# EasyEDA Pro project ProProject_DAC8563-shapphire_2023-07-08.epro

# Schematic Schematic1
Create Date: 2023-07-08; Page Name: P1; Project Name: DAC8563-shapphire; Schematic Name: Schematic1; Update Date: 2023-07-08; Company: 嘉立创EDA; Page Size: A4; Version: V1.0
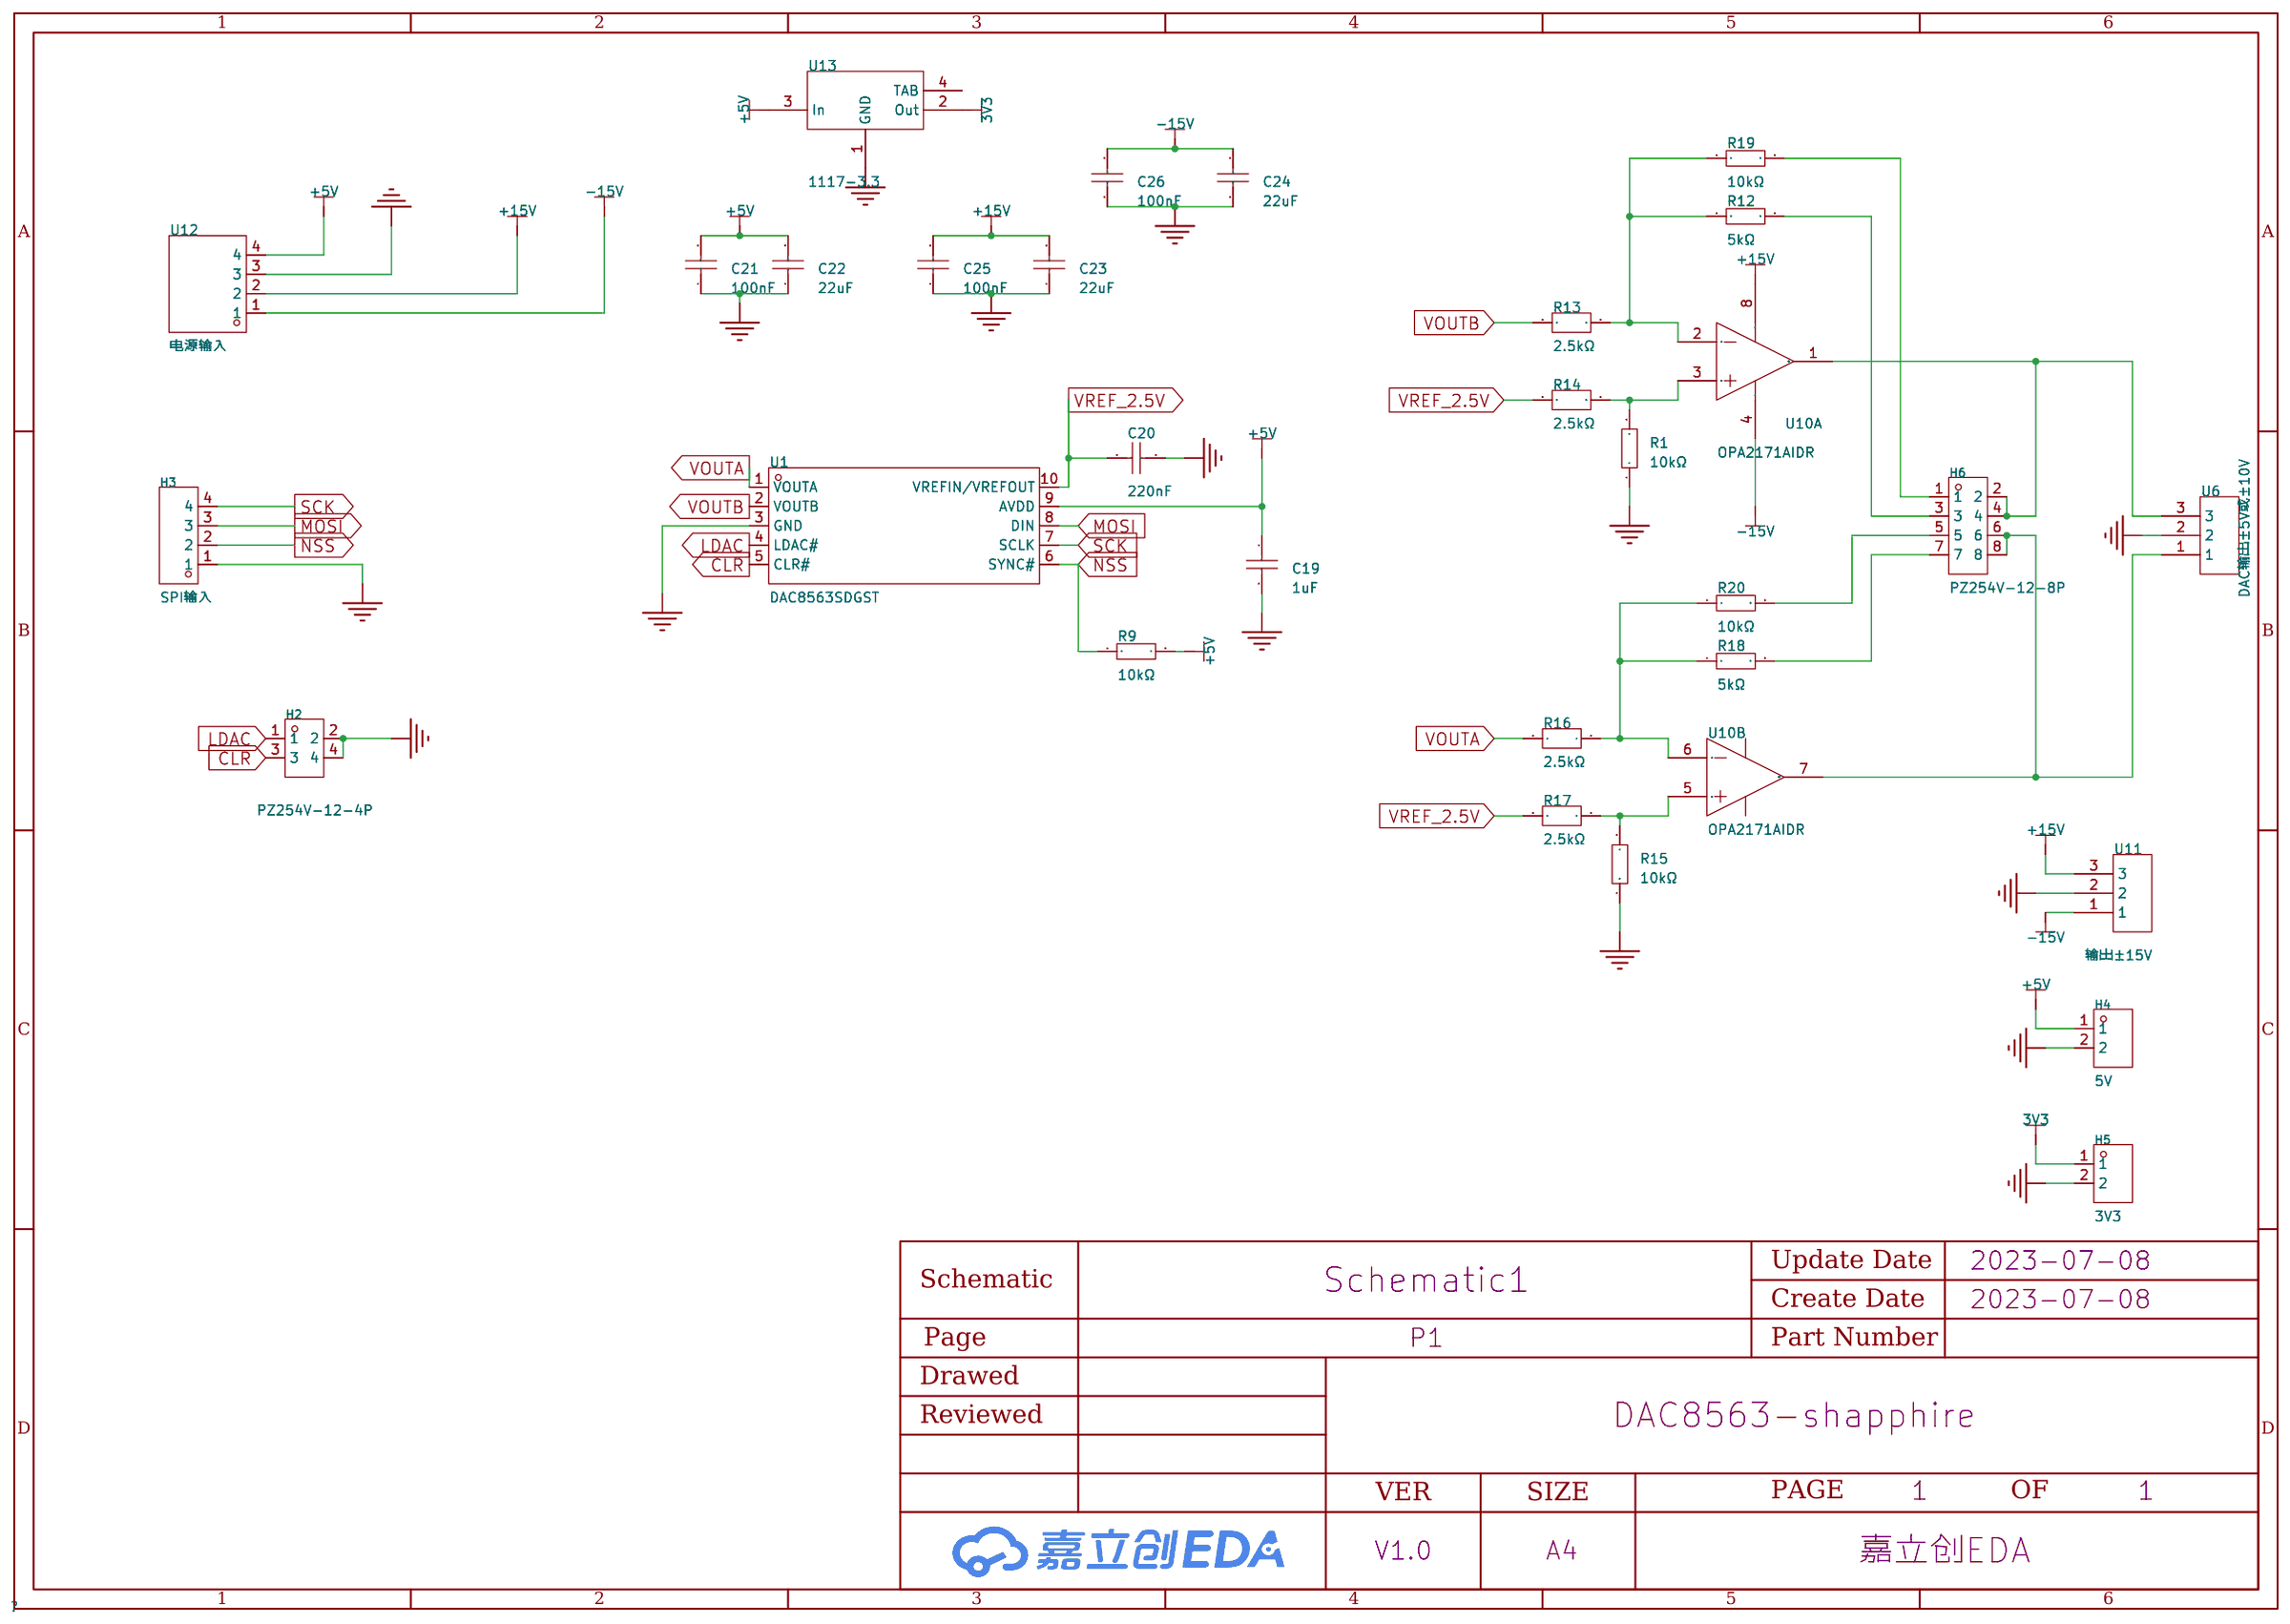
[diagram p0: schematic sheet]

## Parts
C19  1uF  [C0805]
C20  220nF  [C0805]
C21  100nF  [C0805]
C22  22uF  [C0805]
C23  22uF  [C0805]
C24  22uF  [C0805]
C25  100nF  [C0805]
C26  100nF  [C0805]
H2  PZ254V-12-4P  [HDR-TH_4P-P2.54-V-M-R2-C2-S2.54]
H3  SPI输入  [HDR-TH_4P-P2.54-V-M]
H4  5V  [HDR-TH_2P-P2.54-V-M]
H5  3V3  [HDR-TH_2P-P2.54-V-M]
H6  PZ254V-12-8P  [HDR-TH_8P-P2.54-V-M-R2-C4-S2.54]
R1  10kΩ  [R0805]
R9  10kΩ  [R0805]
R12  5kΩ  [R0805]
R13  2.5kΩ  [R0805]
R14  2.5kΩ  [R0805]
R15  10kΩ  [R0805]
R16  2.5kΩ  [R0805]
R17  2.5kΩ  [R0805]
R18  5kΩ  [R0805]
R19  10kΩ  [R0805]
R20  10kΩ  [R0805]
U1  DAC8563SDGST  [VSSOP-10_L3.0-W3.0-P0.50-LS4.9-BL]
U6  DAC输出±5V或±10V  [CONN-TH_3P-P2.50_A2501WV2-3P]
U10  OPA2171AIDR  [SOIC-8_L5.0-W4.0-P1.27-LS6.0-BL]  (sections 1,2)
U11  输出±15V  [CONN-TH_3P-P2.50_A2501WV2-3P]
U12  电源输入  [CONN-TH_B4B-XH-A-LF-SN]
U13  1117-3.3  [SOT-223-3_L6.4-W3.5-P2.30-LS7.0-BR]

## Library data of the parts
C19-C26 = 0805B104K500NT: 容值:100nF;精度:±10%;额定电压:50V;材质(温度系数):X7R;; LCSC Part Name: 100nF ±10% 50V; Supplier Part: C38141; Manufacturer: FH(风华); Supplier Footprint: 0805; JLCPCB Part Class: Extended Part; Datasheet: https://atta.szlcsc.com/upload/public/pdf/source/20170923/C38141_1506149447419988747.pdf; Supplier: LCSC; Tolerance: ±10%; Voltage Rated: 50V; Temperature Coefficient: X7R
H2 = PZ254V-12-4P: 排数:双排;总PIN位数:4;间距:2.54mm;插针结构:2x2P;行距:2.54mm;安装类型:直插;圆针/方针:方针;额定电流:-;额定电压:-;配合针长度:6mm;塑高:2.5mm;端接针长度:3mm;触头材质:黄铜;触头镀层:-;工作温度范围:-40℃~+105℃;颜色:黑色;; LCSC Part Name: 2.54mm 2x2P 直插 方针; Supplier Part: C492419; Manufacturer: XFCN(兴飞); Supplier Footprint: 直插,P=2.54mm; JLCPCB Part Class: 扩展库; Supplier: LCSC; Number of Rows: 双排; Number of Pins: 4; Pitch: 2.54mm; Pin Structure: 2x2P; Row Spacing: 2.54mm; Mounting Type: 直插; Circluar Pins/Square Pins: 方针; Length of Mating Pin: 6mm; Insulation Height: 2.5mm; Length of End Connection Pin: 3mm; Contact Material: 黄铜; Operating Temperature Range: -40℃~+105℃; Color: 黑色
H3 = PZ254V-11-04P: 排数:单排;总PIN位数:4P;间距:2.54mm;插针结构:1x4P;行距:-;安装类型:直插;圆针/方针:方针;额定电流:3A;额定电压:250V;配合针长度:6mm;塑高:2.5mm;端接针长度:3mm;触头材质:-;工作温度范围:-40℃~+105℃;颜色:黑色;; LCSC Part Name: 2.54mm 1x4P 直插 方针; Supplier Part: C2691448; Manufacturer: XFCN(兴飞); Supplier Footprint: 插件,P=2.54mm; JLCPCB Part Class: 扩展库; Datasheet: https://atta.szlcsc.com/upload/public/pdf/source/20200309/C492403_F9F19131791D08044AD4F84F8E751A34.pdf; Supplier: LCSC; Number of Rows: 单排; Number of Pins: 4P; Pitch: 2.54mm; Pin Structure: 1x4P; Mounting Type: 直插; Circluar Pins/Square Pins: 方针; Current Rating (Max): 3A; Voltage Rating (Max): 250V; Length of Mating Pin: 6mm; Insulation Height: 2.5mm; Length of End Connection Pin: 3mm; Operating Temperature Range: -40℃~+105℃; Color: 黑色
H4 H5 = PZ254V-11-02P: 排数:单排;总PIN位数:2P;间距:2.54mm;插针结构:1x2P;行距:-;安装类型:直插;圆针/方针:方针;额定电流:-;额定电压:-;配合针长度:6mm;塑高:2.5mm;端接针长度:3mm;触头材质:黄铜;触头镀层:-;工作温度范围:-40℃~+105℃;颜色:黑色;; LCSC Part Name: 2.54mm 1x2P 直插 方针; Supplier Part: C492401; Manufacturer: XFCN(兴飞); Supplier Footprint: 插件,P=2.54mm; JLCPCB Part Class: 扩展库; Datasheet: https://atta.szlcsc.com/upload/public/pdf/source/20200309/C492401_A812433581A9B211A7FFA413ADDFF0E5.pdf; Supplier: LCSC; Number of Rows: 单排; Number of Pins: 2P; Pitch: 2.54mm; Pin Structure: 1x2P; Mounting Type: 直插; Circluar Pins/Square Pins: 方针; Length of Mating Pin: 6mm; Insulation Height: 2.5mm; Length of End Connection Pin: 3mm; Contact Material: 黄铜; Operating Temperature Range: -40℃~+105℃; Color: 黑色
H6 = PZ254V-12-8P: 排数:双排;总PIN位数:8P;间距:2.54mm;插针结构:2x4P;行距:2.54mm;安装类型:直插;圆针/方针:方针;额定电流:-;额定电压:-;配合针长度:6mm;塑高:2.5mm;端接针长度:3mm;触头材质:黄铜;触头镀层:-;工作温度范围:-40℃~+105℃;颜色:黑色;; LCSC Part Name: 2.54mm 2x4P 直插 方针; Supplier Part: C492421; Manufacturer: XFCN(兴飞); Supplier Footprint: 插件,P=2.54mm; JLCPCB Part Class: 扩展库; Datasheet: https://atta.szlcsc.com/upload/public/pdf/source/20200309/C492421_DC8A206AF99CD7755BD4A5B0BC48200B.pdf; Supplier: LCSC; Number of Rows: 双排; Number of Pins: 8P; Pitch: 2.54mm; Pin Structure: 2x4P; Row Spacing: 2.54mm; Mounting Type: 直插; Circluar Pins/Square Pins: 方针; Length of Mating Pin: 6mm; Insulation Height: 2.5mm; Length of End Connection Pin: 3mm; Contact Material: 黄铜; Operating Temperature Range: -40℃~+105℃; Color: 黑色
R1 R9 R12 R15 R18-R20 = 0805W8F1002T5E_C17414: 电阻类型:厚膜电阻;阻值:10kΩ;精度:±1%;功率:125mW;; LCSC Part Name: 10kΩ ±1% 125mW; Supplier Part: C17414; Manufacturer: UNI-ROYAL(厚声); Manufacturer Part: 0805W8F1002T5E; Supplier Footprint: 0805; JLCPCB Part Class: Basic Part; Datasheet: https://atta.szlcsc.com/upload/public/pdf/source/20200306/C422600_1E6D84923E4A46A82E41ADD87F860B5C.pdf; Supplier: LCSC; Type: 厚膜电阻; Tolerance: ±1%; Power(Watts): 125mW; Temperature Coefficient: ±100ppm/℃; Overload Voltage (Max): 150V; Operating Temperature Range: -55℃~+155℃
R13 R14 R16 R17 = ARG05BTC2501N: 电阻类型:薄膜电阻;阻值:2.5kΩ;精度:±0.1%;功率:125mW;; LCSC Part Name: 2.5kΩ ±0.1% 125mW; Supplier Part: C2828736; Manufacturer: Viking(光颉); Supplier Footprint: 0805; JLCPCB Part Class: Extended Part; Datasheet: https://atta.szlcsc.com/upload/public/pdf/source/20211009/C2828736_56AC36CEB140B466557860EA8A132A37.pdf; Supplier: LCSC; Type: 薄膜电阻; Tolerance: ±0.1%; Power(Watts): 125mW; Temperature Coefficient: ±25ppm/℃; Overload Voltage (Max): 150V; Operating Temperature Range: -55℃~+155℃
U1 = DAC8563SDGST: Supplier Part: C2679492; Manufacturer: TI(德州仪器); Supplier Footprint: VSSOP-10-0.5mm; JLCPCB Part Class: Extended Part; Datasheet: https://atta.szlcsc.com/upload/public/pdf/source/20230221/ACD21AD43AD3151303AC8D1AE3FDF78F.pdf; Supplier: LCSC
U6 U11 = B3B-XH-A(LF)(SN): 参考系列:XH;间距:2.5mm;插针结构:1x3P;排数:1;每排PIN数:3;行距:-;安装方式:-;触头材质:黄铜;; LCSC Part Name: XH 2.5mm 1x3P; Supplier Part: C144394; Manufacturer: JST; Supplier Footprint: 插件,P=2.5mm; JLCPCB Part Class: Extended Part; Datasheet: https://atta.szlcsc.com/upload/public/pdf/source/20180327/C144394_40EBA2F68C817AED706C9EFF4B81600D.pdf; Supplier: LCSC; Reference Series: XH; Pitch: 2.5mm; Pins Structure: 1x3P; Number of Rows: 1; Number of PINs Per Row: 3; Contact Material: 黄铜
U10 = OPA2171AIDR: 运放类型:General Purpose;放大器组数:2;增益带宽积（GBP）:3MHz;压摆率（SR）:1.5 V/us;电源电压:2.7V ~ 36V, ±1.35V ~ 18V;各通道供电电流:475uA;; Supplier Part: C40904; Manufacturer: TI(德州仪器); Supplier Footprint: SOIC-8; JLCPCB Part Class: Extended Part; Datasheet: https://atta.szlcsc.com/upload/public/pdf/source/20150124/1457707260506.pdf; Supplier: LCSC; Amplifier Type: General Purpose; Number of Circuits: 2; Gain Bandwidth Product（GBP）: 3MHz; Slew Rate（SR）: 1.5 V/us; Output Type: Rail-to-Rail; Supply Voltage（Single）: 2.7V ~ 36V, ±1.35V ~ 18V; Iq per channel (Typ): 475uA; Operating Temperature: -40°C ~ 125°C
U12 = B4B-XH-A(LF)(SN): 参考系列:XH;间距:2.5mm;插针结构:1x4P;排数:1;每排PIN数:4;行距:-;安装方式:-;触头材质:黄铜;; LCSC Part Name: XH 2.5mm 1x4P; Supplier Part: C144395; Manufacturer: JST; Supplier Footprint: 插件,P=2.5mm; JLCPCB Part Class: Extended Part; Datasheet: https://atta.szlcsc.com/upload/public/pdf/source/20180327/C144395_D58F0D17A3F58B29FECD1B7D0A791262.pdf; Supplier: LCSC; Reference Series: XH; Pitch: 2.5mm; Pins Structure: 1x4P; Number of Rows: 1; Number of PINs Per Row: 4; Contact Material: 黄铜
U13 = 1117-3.3: LCSC Part Name: 三端稳压器; Supplier Part: C5125088; Manufacturer: IDCHIP(英锐芯); Supplier Footprint: SOT-223; JLCPCB Part Class: 扩展库; Datasheet: https://atta.szlcsc.com/upload/public/pdf/source/20220816/063B23F8025063688804E1CFFCDD269A.pdf; Supplier: LCSC

## Nets
3V3: H5.1 U13.2(Out)
+5V: C19.1 C21.2 C22.2 H4.1 R9.2 U1.9(AVDD) U12.4 U13.3(In)
+15V: C23.2 C25.2 U10.8(V+) U11.3 U12.2
-15V: C24.2 C26.2 U10.4(V-) U11.1 U12.1
GND: C19.2 C20.2 C21.1 C22.1 C23.1 C24.1 C25.1 C26.1 H2.2 H2.4 H3.1 H4.2 H5.2 R1.1 R15.1 U1.3(GND) U6.2 U11.2 U12.3 U13.1(GND)
CLR: H2.3 U1.5(CLR#)
LDAC: H2.1 U1.4(LDAC#)
MOSI: H3.3 U1.8(DIN)
NSS: H3.2 R9.1 U1.6(SYNC#)
SCK: H3.4 U1.7(SCLK)
VOUTA: R16.2 U1.1(VOUTA)
VOUTB: R13.2 U1.2(VOUTB)
VREF_2.5V: C20.1 R14.2 R17.2 U1.10(VREFIN/VREFOUT)
$1N6932: R1.2 R14.1 U10.3(IN A+)
$1N8400: R15.2 R17.1 U10.5(IN B+)
$1N12763: R12.1 R13.1 R19.1 U10.2(IN A-)
$1N12772: R16.1 R18.1 R20.1 U10.6(IN B-)
$1N13293: H6.3 R12.2
$1N13298: H6.1 R19.2
$1N13357: H6.5 R20.2
$1N13362: H6.7 R18.2
$1N13841: H6.6 H6.8 U6.1 U10.7(OUT B)
$1N13850: H6.2 H6.4 U6.3 U10.1(OUT A)

Not connected (* = marked no-connect by the designer): U13 4(TAB)

# Schematic Schematic2
Create Date: 2023-07-07; Page Name: P1; Project Name: DAC8563; Schematic Name: Schematic2; Update Date: 2023-07-07; Company: 嘉立创EDA; Page Size: A4; Version: V1.0
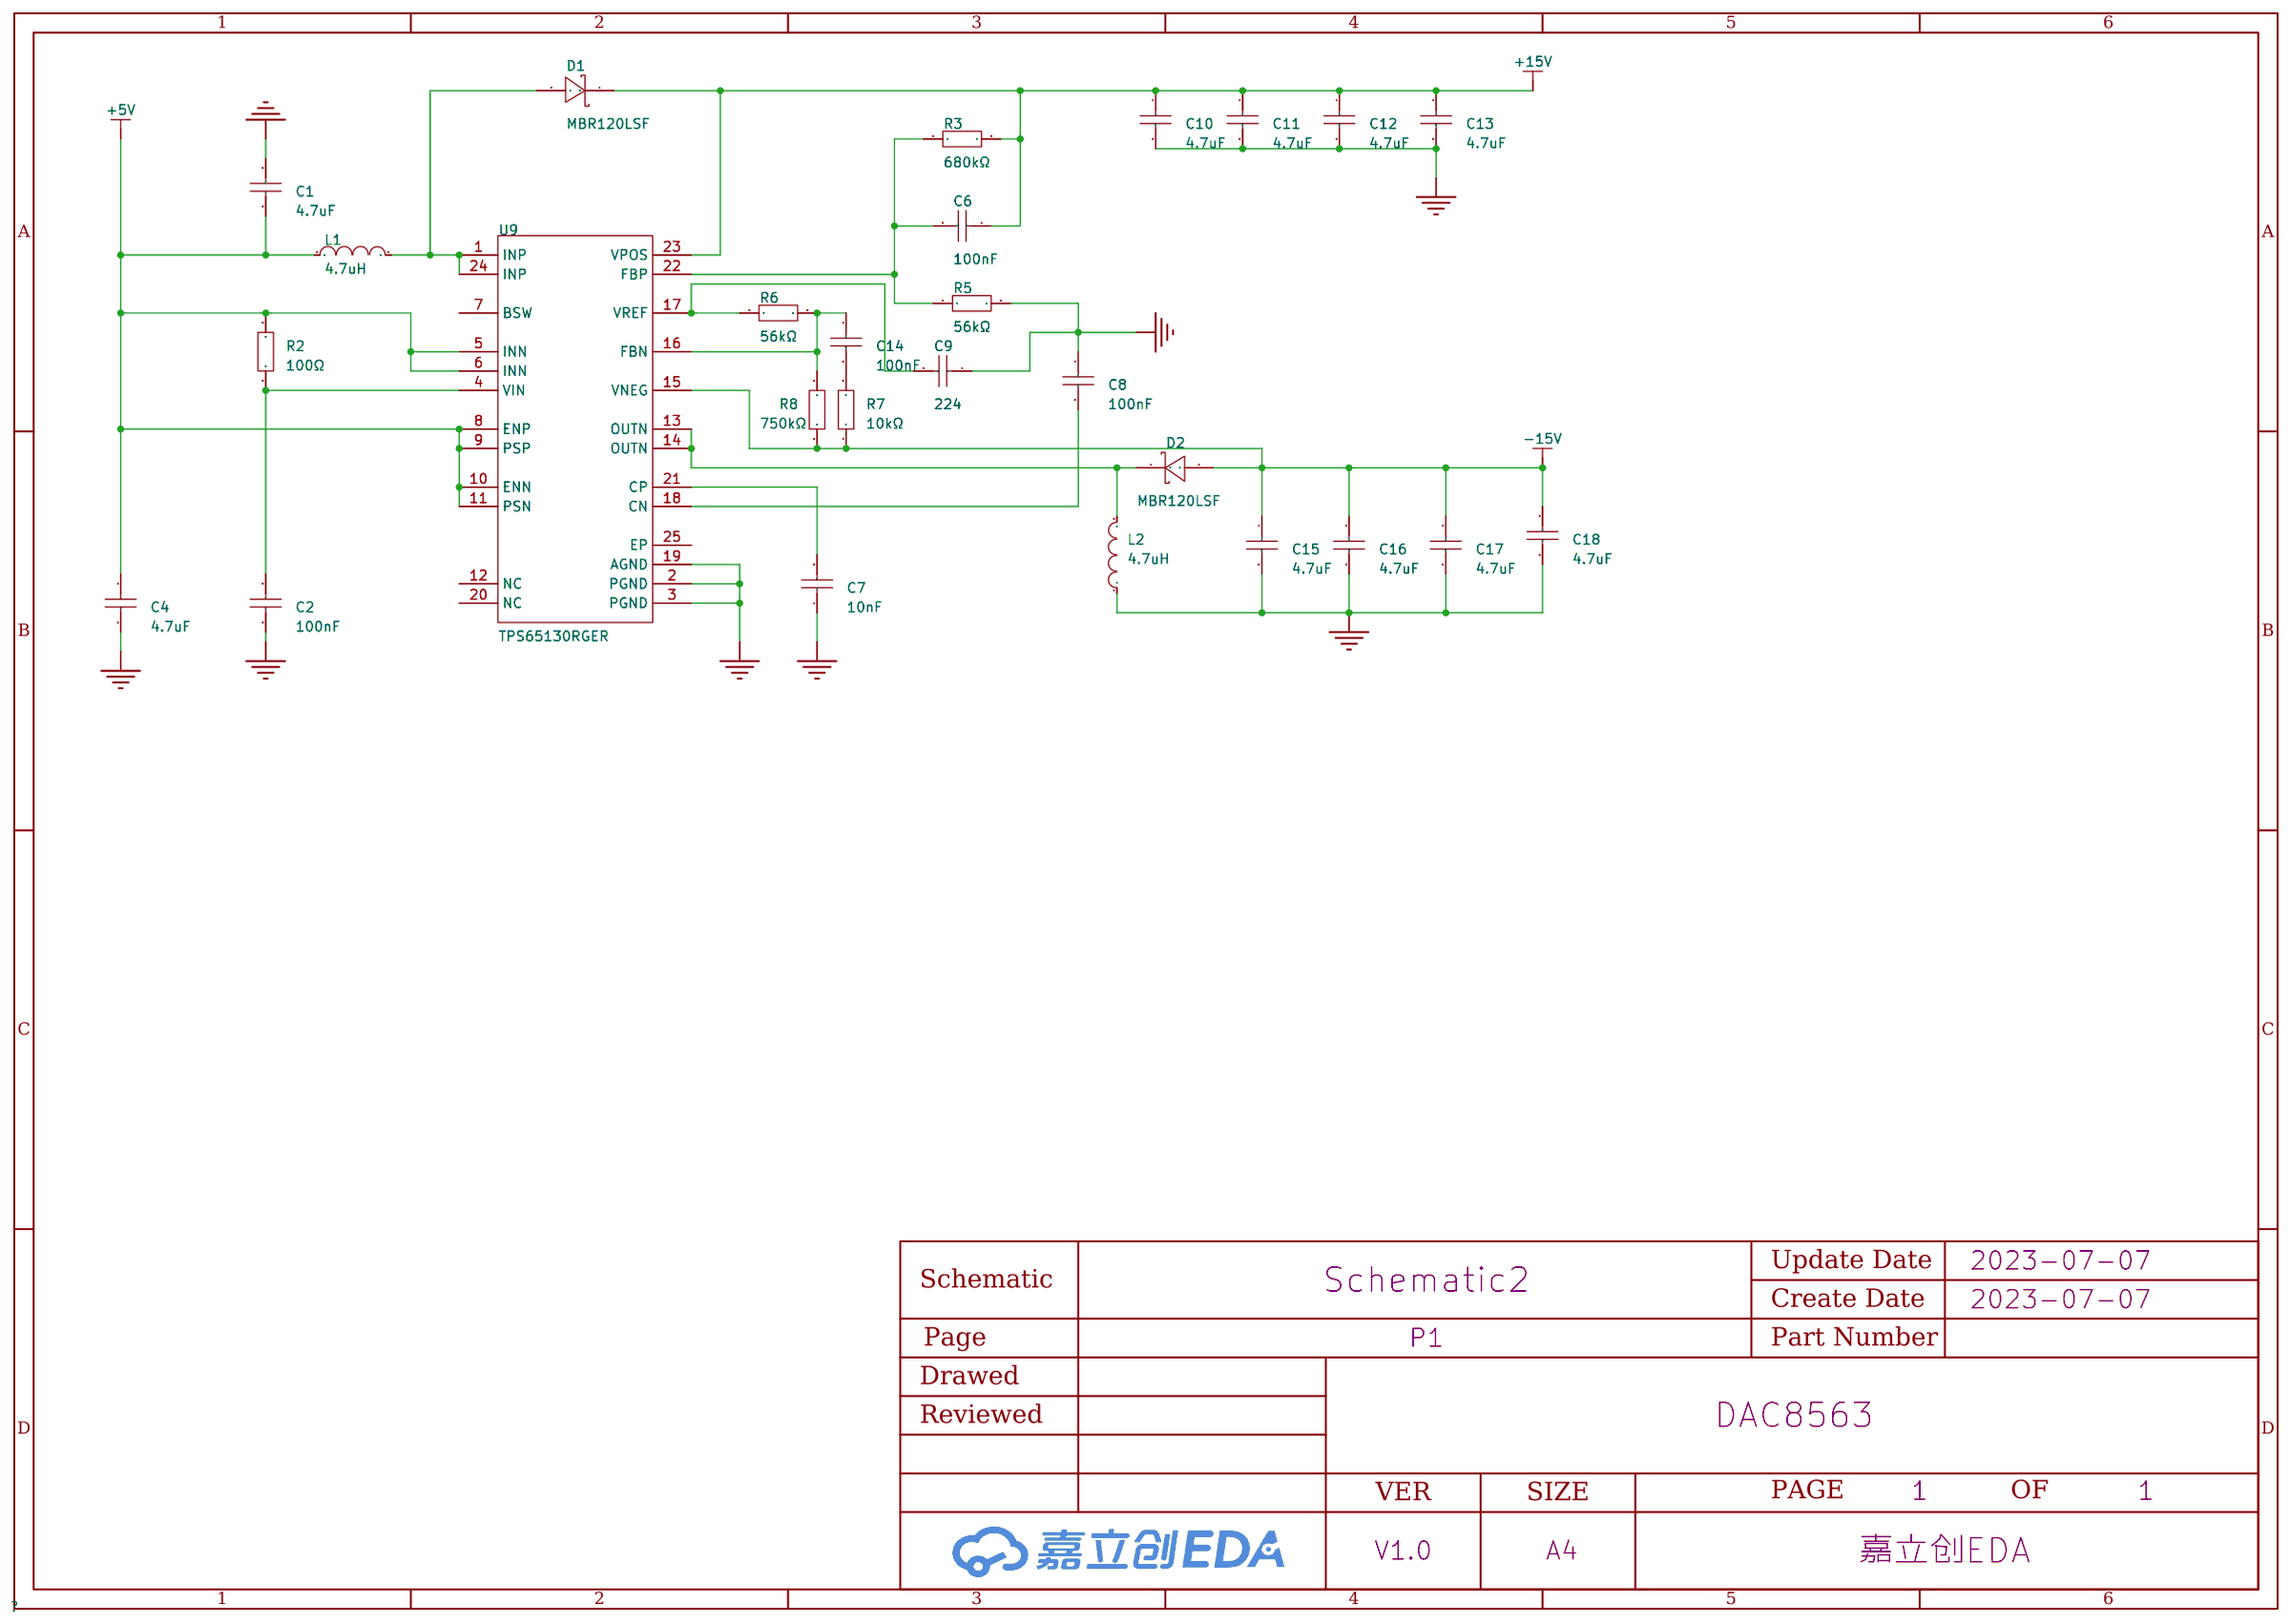
[diagram p1: schematic sheet]

## Parts
C1  4.7uF  [C0805]
C2  100nF  [C0805]
C4  4.7uF  [C0805]
C6  100nF  [C0805]
C7  10nF  [C0805]
C8  100nF  [C0805]
C9  224  [C0805]
C10  4.7uF  [C0805]
C11  4.7uF  [C0805]
C12  4.7uF  [C0805]
C13  4.7uF  [C0805]
C14  100nF  [C0805]
C15  4.7uF  [C0805]
C16  4.7uF  [C0805]
C17  4.7uF  [C0805]
C18  4.7uF  [C0805]
D1  MBR120LSF  [SOD-123_L2.8-W1.8-LS3.7-RD]
D2  MBR120LSF  [SOD-123_L2.8-W1.8-LS3.7-RD]
L1  4.7uH  [IND-SMD_L4.0-W4.0]
L2  4.7uH  [IND-SMD_L4.0-W4.0]
R2  100Ω  [R0805]
R3  680kΩ  [R0805]
R5  56kΩ  [R0805]
R6  56kΩ  [R0805]
R7  10kΩ  [R0805]
R8  750kΩ  [R0805]
U9  TPS65130RGER  [VQFN-24_L4.0-W4.0-P0.50-TL-EP]

## Library data of the parts
C1 C4 = CL21A475KAQNNNE: 容值:4.7uF;精度:±10%;额定电压:25V;材质(温度系数):X5R;; LCSC Part Name: 4.7uF ±10% 25V; Supplier Part: C1779; Manufacturer: SAMSUNG(三星); Supplier Footprint: 0805; JLCPCB Part Class: Basic Part; Datasheet: https://atta.szlcsc.com/upload/public/pdf/source/20160103/1457707696447.pdf; Supplier: LCSC; Tolerance: ±10%; Voltage Rated: 25V; Temperature Coefficient: X5R
C2 C6-C18 = 0805B104K500NT: 容值:100nF;精度:±10%;额定电压:50V;材质(温度系数):X7R;; LCSC Part Name: 100nF ±10% 50V; Supplier Part: C38141; Manufacturer: FH(风华); Supplier Footprint: 0805; JLCPCB Part Class: Extended Part; Datasheet: https://atta.szlcsc.com/upload/public/pdf/source/20170923/C38141_1506149447419988747.pdf; Supplier: LCSC; Tolerance: ±10%; Voltage Rated: 50V; Temperature Coefficient: X7R
D1 D2 = MBR120LSF: 直流反向耐压(Vr):20V;平均整流电流(Io):1A;正向压降(Vf):600mV@1A;; LCSC Part Name: 20V 1A 600mV@1A; Supplier Part: C130880; Manufacturer: SHIKUES(时科); Supplier Footprint: SOD-123; JLCPCB Part Class: Extended Part; Datasheet: https://atta.szlcsc.com/upload/public/pdf/source/20170918/C130880_1505703436167975387.pdf; Supplier: LCSC; Reverse Voltage (Vr): 20V; Average Rectified Current (Io): 1A; Forward Voltage (Vf@If): 600mV@1A
L1 L2 = SWPA4030S4R7MT: 直流电阻(DCR):78mΩ;精度:±20%;电感值:4.7uH;额定电流:2A;; LCSC Part Name: 4.7uH ±20%; Supplier Part: C57269; Manufacturer: Sunlord(顺络); Supplier Footprint: SMD; JLCPCB Part Class: Extended Part; Datasheet: https://atta.szlcsc.com/upload/public/pdf/source/20161024/1477287957557.pdf; Supplier: LCSC; DC Resistance (DCR): 78mΩ; Tolerance: ±20%; Height: 3mm; Width: 4mm; Rated Current: 2A; Length: 4mm
R2 = 0805W8F1000T5E: 电阻类型:厚膜电阻;阻值:100Ω;精度:±1%;功率:125mW;; LCSC Part Name: 100Ω ±1% 125mW; Supplier Part: C17408; Manufacturer: UNI-ROYAL(厚声); Supplier Footprint: 0805; JLCPCB Part Class: Basic Part; Datasheet: https://atta.szlcsc.com/upload/public/pdf/source/20200306/C422600_1E6D84923E4A46A82E41ADD87F860B5C.pdf; Supplier: LCSC; Type: 厚膜电阻; Tolerance: ±1%; Power(Watts): 125mW; Temperature Coefficient: ±100ppm/℃; Overload Voltage (Max): 150V; Operating Temperature Range: -55℃~+155℃
R3 R5-R8 = 0805W8F1002T5E_C17414: 电阻类型:厚膜电阻;阻值:10kΩ;精度:±1%;功率:125mW;; LCSC Part Name: 10kΩ ±1% 125mW; Supplier Part: C17414; Manufacturer: UNI-ROYAL(厚声); Manufacturer Part: 0805W8F1002T5E; Supplier Footprint: 0805; JLCPCB Part Class: Basic Part; Datasheet: https://atta.szlcsc.com/upload/public/pdf/source/20200306/C422600_1E6D84923E4A46A82E41ADD87F860B5C.pdf; Supplier: LCSC; Type: 厚膜电阻; Tolerance: ±1%; Power(Watts): 125mW; Temperature Coefficient: ±100ppm/℃; Overload Voltage (Max): 150V; Operating Temperature Range: -55℃~+155℃
U9 = TPS65130RGER: 功能类型:升压型；升降压型;同步整流:否;输出类型:可调;输出通道数:2;拓扑结构:升压式；降压式-升压式;输入电压:2.7V~5.5V;输出电压:±15V;输出电流(最大值):700mA;开关频率:1.38MHz;工作温度:-40℃~+85℃@(TA);; LCSC Part Name: 升降压型 升压型 Vin=2.7V~5.5V Vout=±15V 700mA; Supplier Part: C54989; Manufacturer: TI(德州仪器); Supplier Footprint: QFN-24(4x4); JLCPCB Part Class: Extended Part; Datasheet: https://atta.szlcsc.com/upload/public/pdf/source/20170925/C54989_1506321722096990529.pdf; Supplier: LCSC; Function: 升压型；升降压型; Synchronous Rectification: 否; Output Type: 可调; Number of Outputs: 2; Topology: 升压式；降压式-升压式; Input Voltage: 2.7V~5.5V; Output Voltage: ±15V; Output Current (Max): 700mA; Switching Frequency: 1.38MHz; Operating Temperature: -40℃~+85℃@(TA)

## Nets
+5V: C1.1 C4.2 L1.1 R2.2 U9.5(INN) U9.6(INN) U9.8(ENP) U9.9(PSP) U9.10(ENN) U9.11(PSN)
+15V: C6.1 C10.1 C11.1 C12.1 C13.1 D1.1(C) R3.2 U9.23(VPOS)
-15V: C15.1 C16.1 C17.1 C18.1 D2.2(A) R7.1 R8.2 U9.15(VNEG)
GND: C1.2 C2.1 C4.1 C7.1 C8.1 C9.1 C10.2 C11.2 C12.2 C13.2 C15.2 C16.2 C17.2 C18.2 L2.1 R5.2 U9.2(PGND) U9.3(PGND) U9.19(AGND)
Net-(C2-2): C2.2 R2.1 U9.4(VIN)
Net-(C6-2): C6.2 R3.1 R5.1 U9.22(FBP)
Net-(C7-2): C7.2 U9.21(CP)
Net-(C8-2): C8.2 U9.18(CN)
Net-(C9-2): C9.2 R6.1 U9.17(VREF)
Net-(C14-1): C14.1 R6.2 R8.1 U9.16(FBN)
Net-(C14-2): C14.2 R7.2
Net-(D1-2): D1.2(A) L1.2 U9.1(INP) U9.24(INP)
Net-(D2-1): D2.1(C) L2.2 U9.13(OUTN) U9.14(OUTN)

Not connected (* = marked no-connect by the designer): U9 7(BSW) 12(NC) 20(NC) 25(EP)

# Board PCB1
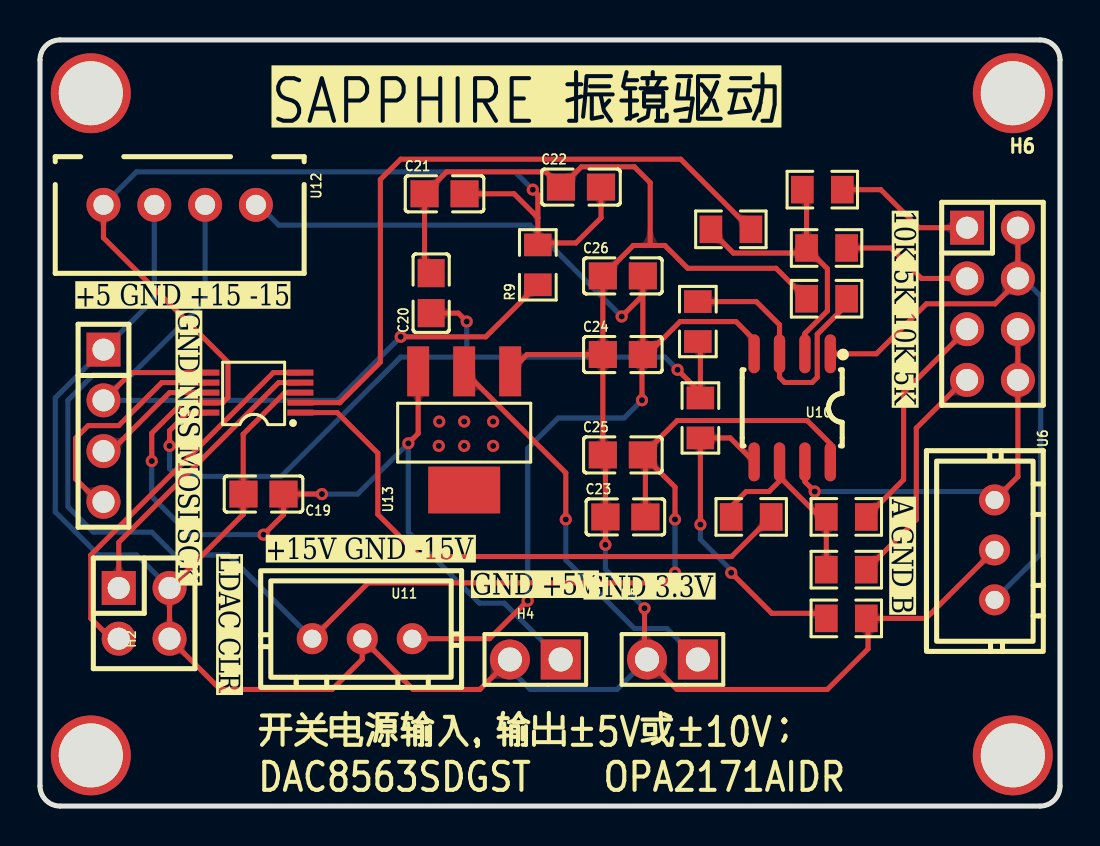
[diagram p2: board, top side]
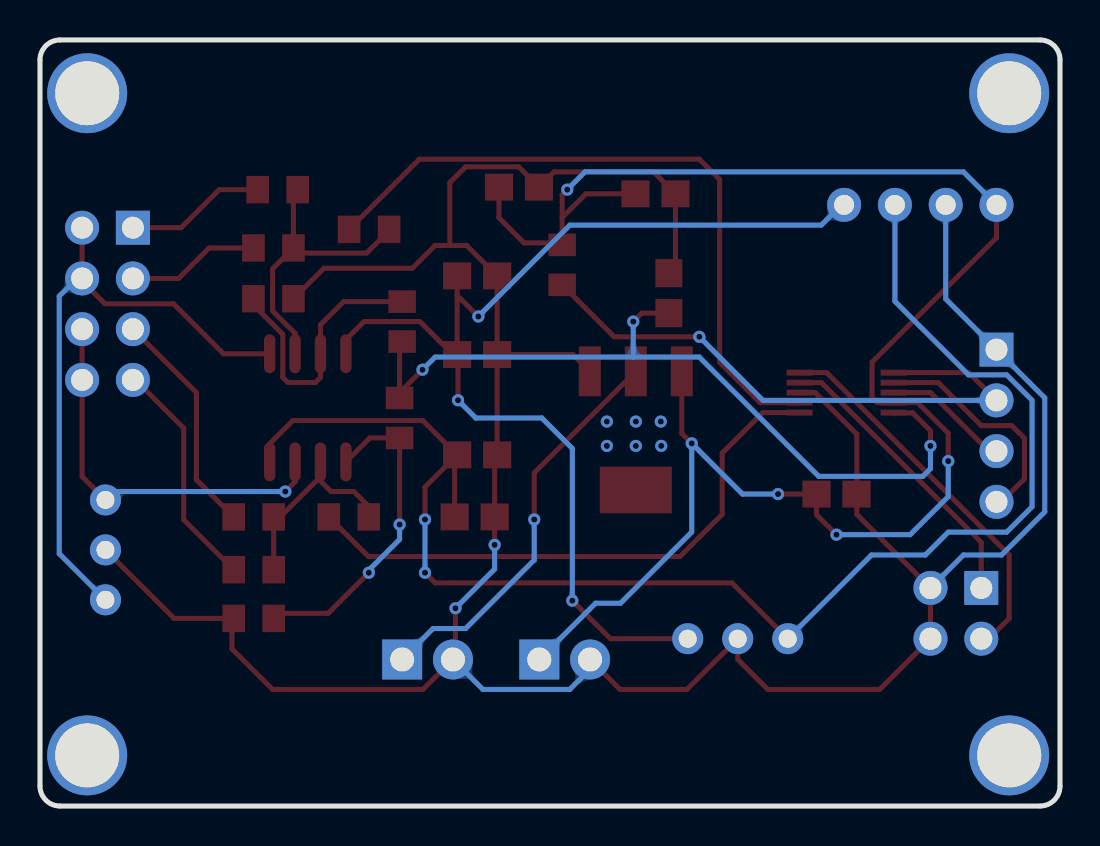
[diagram p3: board, bottom side, seen from below]

Outline 51 x 38.35 mm; copper layers: Top Layer, Bottom Layer. Coordinates in mm from the lower left corner of the outline.
Outline path: 0,37.35 0,1 arc(0.29,0.29) 1,0 50,0 arc(50.71,0.29) 51,1 51,37.35 arc(50.71,38.06) 50,38.35 1,38.35 arc(0.29,38.06) 0,37.35
Stack: Top Layer 0.035mm / Dielectric1 1.51mm FR4 er 4.5 / Bottom Layer 0.035mm

## Design rules (mm)
template: JLCPCB Capability(Two Layers Board)
spacing copperThickness1oz (default): track to track 0.102, other pairs 0.152 to 0.3
spacing copperThickness2oz: track to track 0.203, other pairs 0.152 to 0.3
track width copperThickness1oz (default): min 0.127, default 0.254, max 2.54
track width copperThickness2oz: min 0.203, default 0.254, max 2.54
differential pair differentialPair (default): width min 0.127, default 0.254, max 2.54; gap min 0.152, default 0.152
via viaSize (default): diameter min 0.5, default 0.61, max 10; hole min 0.3, default 0.305, max 6.3

## Placement (name value [footprint] x y rotation side)
C19  1uF  [C0805]  11.18 15.62 180 top
C20  220nF  [C0805]  19.56 25.67 90 top
C21  100nF  [C0805]  20.23 30.65 0 top
C22  22uF  [C0805]  27.05 30.98 0 top
C23  22uF  [C0805]  29.27 14.47 0 top
C24  22uF  [C0805]  29.14 22.6 0 top
C25  100nF  [C0805]  29.14 17.58 0 top
C26  100nF  [C0805]  29.14 26.54 0 top
H2  PZ254V-12-4P  [HDR-TH_4P-P2.54-V-M-R2-C2-S2.54]  5.21 9.65 270 top
H3  SPI输入  [HDR-TH_4P-P2.54-V-M]  3.17 19.04 270 top
H4  5V  [HDR-TH_2P-P2.54-V-M]  24.76 7.34 180 top
H5  3V3  [HDR-TH_2P-P2.54-V-M]  31.62 7.34 180 top
H6  PZ254V-12-8P  [HDR-TH_8P-P2.54-V-M-R2-C4-S2.54]  47.62 25.14 270 top
NOREF  -  [Pad_e7564]  2.54 2.53 0 top
NOREF#2  -  [Pad_e7571]  48.64 35.68 0 top
NOREF#3  -  [Pad_e7572]  2.54 35.68 0 top
NOREF#4  -  [Pad_e7565]  48.64 2.53 0 top
R1  10kΩ  [R0805]  39.33 25.39 0 top
R9  10kΩ  [R0805]  24.89 27.09 90 top
R12  5kΩ  [R0805]  39.33 27.94 0 top
R13  2.5kΩ  [R0805]  34.54 28.87 0 top
R14  2.5kΩ  [R0805]  32.89 24.25 270 top
R15  10kΩ  [R0805]  40.31 9.39 180 top
R16  2.5kΩ  [R0805]  35.56 14.47 0 top
R17  2.5kΩ  [R0805]  33.02 19.43 90 top
R18  5kΩ  [R0805]  40.31 11.83 0 top
R19  10kΩ  [R0805]  39.12 30.86 0 top
R20  10kΩ  [R0805]  40.31 14.47 0 top
U1  DAC8563SDGST  [VSSOP-10_L3.0-W3.0-P0.50-LS4.9-BL]  10.67 20.7 90 top
U6  DAC输出±5V或±10V  [CONN-TH_3P-P2.50_A2501WV2-3P]  47.73 12.82 270 top
U10  OPA2171AIDR  [SOIC-8_L5.0-W4.0-P1.27-LS6.0-BL]  37.61 19.93 180 top
U11  输出±15V  [CONN-TH_3P-P2.50_A2501WV2-3P]  16.11 8.38 180 top
U12  电源输入  [CONN-TH_B4B-XH-A-LF-SN]  6.98 30.09 180 top
U13  1117-3.3  [SOT-223-3_L6.4-W3.5-P2.30-LS7.0-BR]  21.21 18.79 90 top

## Footprints (pads in the part's own frame, mm; a bottom-side part is the same pattern mirrored in y, then rotated)
C0805
  rect 1.41x1.35 smd: 1(-1,0) 2(1,0)
CONN-TH_3P-P2.50_A2501WV2-3P
  round 1.55 hole 0.9: 1(-2.5,0) 2(0,0) 3(2.5,0)
CONN-TH_B4B-XH-A-LF-SN
  round 1.7 hole 1: 1(-3.81,0) 2(-1.27,0) 3(1.27,0) 4(3.81,0)
HDR-TH_2P-P2.54-V-M
  rect 2x2 hole 1.2: 1(-1.27,0)
  round 2 hole 1.2: 2(1.27,0)
HDR-TH_4P-P2.54-V-M
  rect 1.7x1.7 hole 1.1: 1(-3.81,0)
  round 1.7 hole 1.1: 2(-1.27,0) 3(1.27,0) 4(3.81,0)
HDR-TH_4P-P2.54-V-M-R2-C2-S2.54
  rect 1.7x1.7 hole 1.1: 1(-1.27,-1.27)
  round 1.7 hole 1.1: 2(-1.27,1.27) 3(1.27,-1.27) 4(1.27,1.27)
HDR-TH_8P-P2.54-V-M-R2-C4-S2.54
  rect 1.7x1.7 hole 1.1: 1(-3.81,-1.27)
  round 1.7 hole 1.1: 2(-3.81,1.27) 3(-1.27,-1.27) 4(-1.27,1.27) 5(1.27,-1.27) 6(1.27,1.27) 7(3.81,-1.27) 8(3.81,1.27)
Pad_e7564
  round 4 hole 3.2: 11(0,0)
Pad_e7565
  round 4 hole 3.2: 12(0,0)
Pad_e7571
  round 4 hole 3.2: 12(0,0)
Pad_e7572
  round 4 hole 3.2: 12(0,0)
R0805
  rect 1.133x1.377 smd: 1(-1,0) 2(1,0)
SOIC-8_L5.0-W4.0-P1.27-LS6.0-BL
  oval 0.569x1.95 smd: 1(-1.905,-2.705) 2(-0.635,-2.705) 3(0.635,-2.705) 4(1.905,-2.705) 5(1.905,2.705) 6(0.635,2.705) 7(-0.635,2.705) 8(-1.905,2.705)
SOT-223-3_L6.4-W3.5-P2.30-LS7.0-BR
  rect 2.5x1.1 smd: 1(2.97,-2.3) 2(2.97,0) 3(2.97,2.3)
  rect 2.34x3.6 smd: 4(-2.97,0)
VSSOP-10_L3.0-W3.0-P0.50-LS4.9-BL
  rect 0.3x1.3 smd: 1(-1,-2.35) 2(-0.5,-2.35) 3(0,-2.35) 4(0.5,-2.35) 5(1,-2.35) 6(1,2.35) 7(0.5,2.35) 8(0,2.35) 9(-0.5,2.35) 10(-1,2.35)

## Nets
As in the schematic.

Pads without a net: NOREF 11; NOREF#2 12; NOREF#3 12; NOREF#4 12; U13 4

## Via types
v1: diameter 0.61, hole 0.305, Top Layer to Bottom Layer, 26 vias

## Routing (per net, layer and track width the routed paths; a pad name or vN(x,y) marks a point on that pad's centre or on a via; arc(x,y) is an arc through that point)
3V3: length 20.2
  Top Layer w0.254: v1(26.29,14.35) 26.29,16.68 U13.2
  Bottom Layer w0.254: v1(26.29,14.35) 26.29,12.31 29.72,8.88 31.34,8.88 H5.1
+5V: length 89.4
  Top Layer w0.254: v1(5.59,17.27) 5.59,18.66 7.12,20.2 U1.9 9.14,20.2 9.4,20.45 9.4,22.22 3.17,28.44 U12.4 ; C21.2 23.7,30.65 24.89,29.46 ; v1(14.1,15.62) 12.18,15.62 ; v1(18.41,18.16) 18.91,18.65 U13.3 ; v1(24.64,30.86) 24.89,30.6 24.89,29.46 ; C22.2 28.05,29.44 26.8,28.19 24.99,28.19 R9.2 24.89,29.46 ; v1(11.18,13.58) 12.18,14.58 C19.1
  Bottom Layer w0.254: v1(11.18,13.58) 7.49,13.58 5.59,15.49 v1(5.59,17.27) ; v1(24.64,30.86) 23.75,31.74 4.83,31.74 U12.4 ; H4.1 23.22,10.16 21.97,10.16 18.41,13.71 v1(18.41,18.16) 15.88,15.62 v1(14.1,15.62)
+15V: length 74.5
  Top Layer w0.254: C23.2 30.27,17.45 ; 30.27,17.45 C25.2 31.86,19.3 38.35,19.3 39.52,18.14 U10.8 ; 30.27,17.45 31.75,15.97 v1(31.75,14.35) ; v1(31.75,11.68) 31.24,11.17 16.41,11.17 U11.3
  Bottom Layer w0.254: U12.2 8.25,25.27 4.57,21.58 2.67,21.58 1.4,20.31 1.4,14.98 2.67,13.71 5.59,13.71 6.73,12.57 9.42,12.57 U11.3 ; v1(31.75,11.68) v1(31.75,14.35)
-15V: length 56.6
  Top Layer w0.254: 30.14,25.57 v1(29.08,24.51) ; 30.14,25.57 C24.2 ; 30.14,25.57 C26.2 ; C24.2 30.1,22.56 v1(30.1,20.31) ; C24.2 30.35,22.6 32,24.25 34.8,24.25 35.71,23.34 U10.4 ; U11.1 22.48,8.38 v1(24.38,10.28)
  Bottom Layer w0.254: v1(24.38,10.28) 24.38,17.9 25.91,19.43 29.21,19.43 v1(30.1,20.31) ; v1(29.08,24.51) 24.51,29.08 11.94,29.08 10.92,30.09 U12.1
GND: length 149
  Top Layer w0.254: C24.1 C25.1 28.27,17.45 C23.1 v1(28.27,13.08) ; C24.1 C26.1 29.67,28.06 30.51,28.06 ; C24.1 24.35,22.6 U13.1 ; 10.16,15.63 10.16,14.6 6.48,10.92 H2.4 9.02,5.84 14.6,5.84 16.11,7.35 U11.2 18.65,5.84 22,5.84 23.5,7.34 ; 10.16,15.63 10.16,18.61 12.24,20.7 U1.3 ; 10.16,15.63 C19.2 ; 30.51,28.06 30.51,31.21 29.72,32 27.07,32 C22.1 25.29,31.74 20.32,31.74 C21.1 19.23,27 C20.2 ; 30.51,28.06 31.24,28.06 32.38,26.92 36.8,26.92 R1.1 ; U6.2 44.3,9.39 R15.1 41.4,9.31 41.4,7.87 39.37,5.84 31.85,5.84 H5.2 30.23,7.46 v1(30.23,9.9)
  Bottom Layer w0.254: U12.3 5.72,25.39 H3.1 0.76,20.43 0.76,14.73 2.92,12.57 4.83,12.57 6.48,10.92 ; 23.5,7.34 23.5,6.85 24.51,5.84 28.85,5.84 H5.2 ; v1(28.27,13.08) 28.27,11.86 v1(30.23,9.9)
(no net):
  vias: v1(19.94,18.03) v1(19.96,19.25) v1(21.21,19.25) v1(21.21,18.03) v1(22.66,19.25) v1(22.66,18.03)
CLR: length 19.3
  Top Layer w0.254: H2.3 3.56,8.76 3.17,8.76 2.54,9.39 2.54,12.57 11.67,21.7 U1.5
LDAC: length 14.7
  Top Layer w0.254: 3.94,10.92 3.94,13.2 11.93,21.2 U1.4
MOSI: length 6.4
  Top Layer w0.254: U1.8 6.48,20.7 3.55,17.77 H3.3
NSS: length 29.8
  Top Layer w0.254: v1(18.03,23.49) 22.29,23.49 R9.1 ; H3.2 4.56,21.7 U1.6
  Bottom Layer w0.254: H3.2 14.85,20.31 v1(18.03,23.49)
SCK: length 11.6
  Top Layer w0.254: U1.7 6.09,21.2 3.94,19.05 2.41,19.05 1.78,18.41 1.78,16.38 2.93,15.23 H3.4
VOUTA: length 29.1
  Top Layer w0.254: R16.2 34.58,12.49 19,12.49 16.89,14.6 16.89,17.66 14.86,19.7 U1.1
VOUTB: length 34.4
  Top Layer w0.254: U1.2 14.98,20.2 14.99,20.19 17.02,22.22 17.02,31.36 18.03,32.38 32.03,32.38 R13.2
VREF_2.5V: length 40.6
  Top Layer w0.254: R14.2 33.02,23.12 33.02,20.7 ; 33.02,20.7 v1(31.88,21.84) ; 33.02,20.7 R17.2 ; U1.10 8.3,19.68 7.37,19.68 6.48,18.79 v1(6.48,18.03) ; C20.1 20.91,24.67 v1(21.34,24.25)
  Bottom Layer w0.254: 21.34,22.47 31.24,22.47 v1(31.88,21.84) ; 21.34,22.47 v1(21.34,24.25) ; 21.34,22.47 18.03,22.47 12.06,16.5 6.86,16.5 6.48,16.89 v1(6.48,18.03)
$1N6932: length 13.8
  Top Layer w0.254: R1.2 40.13,25.2 40.13,24.89 38.86,23.62 38.86,21.46 38.61,21.2 37.23,21.2 36.98,21.46 U10.3 36.98,24.09 35.81,25.25 R14.1
$1N8400: length 16.3
  Top Layer w0.254: v1(34.56,11.68) 36.59,9.65 39.06,9.65 R15.2 ; v1(33.02,14.09) R17.1 34.51,18.43 U10.5
  Bottom Layer w0.254: v1(33.02,14.09) 33.02,13.35 34.56,11.81 v1(34.56,11.68)
$1N12763: length 14.6
  Top Layer w0.254: R12.1 38.07,27.68 34.67,27.68 33.54,28.81 R13.1 ; R12.1 38.33,30.64 R19.1 ; R12.1 39.37,26.89 39.37,24.79 38.25,23.66 U10.2
$1N12772: length 10.2
  Top Layer w0.254: R16.1 34.56,15 35.31,15.74 36.45,15.74 36.98,16.27 36.98,16.49 ; R18.1 R20.1 38.99,14.47 36.98,16.49 ; U10.6 36.98,16.49
$1N13293: length 6.7
  Top Layer w0.254: H6.3 44.07,26.41 42.54,27.94 R12.2
$1N13298: length 7
  Top Layer w0.254: H6.1 43.94,28.95 42.04,30.86 R19.2
$1N13357: length 11.5
  Top Layer w0.254: R20.2 43.18,16.34 43.18,20.7 H6.5
$1N13362: length 11.7
  Top Layer w0.254: H6.7 46.23,21.33 43.81,18.92 43.81,14.33 R18.2
$1N13841: length 19.9
  Top Layer w0.254: H6.6 H6.8 48.9,16.49 U6.1 ; U10.7 38.25,16.23 v1(38.74,15.74)
  Bottom Layer w0.254: U6.1 47.31,15.74 v1(38.74,15.74)
$1N13850: length 31.2
  Top Layer w0.254: U10.1 41.82,22.64 44.32,25.14 47.75,25.14 48.9,26.28 H6.4 H6.2
  Bottom Layer w0.254: U6.3 50.04,12.63 50.04,25.52 49.15,26.41 H6.4

## Copper pours and planes (outline as drawn; the poured copper is in the pictures)
GND on Top Layer: 0,33.14 51.05,33.14 51.05,5.08 0,5.08
GND on Bottom Layer: 0,33.14 51.05,33.14 51.05,5.08 0,5.08

Small or netless copper shapes (teardrops, artwork), in the pictures only: 133 on Top Layer, 38 on Bottom Layer

## Text on the board
Top Silkscreen Layer: A GND B | 10K 5K 10K 5K | +15V GND -15V | GND +5V | GND 3.3V | GND NSS MOSI SCK | LDAC CLR | +5 GND +15 -15 | 开关电源输入，输出±5V或±10V； / DAC8563SDGST    OPA2171AIDR | SAPPHIRE 振镜驱动
